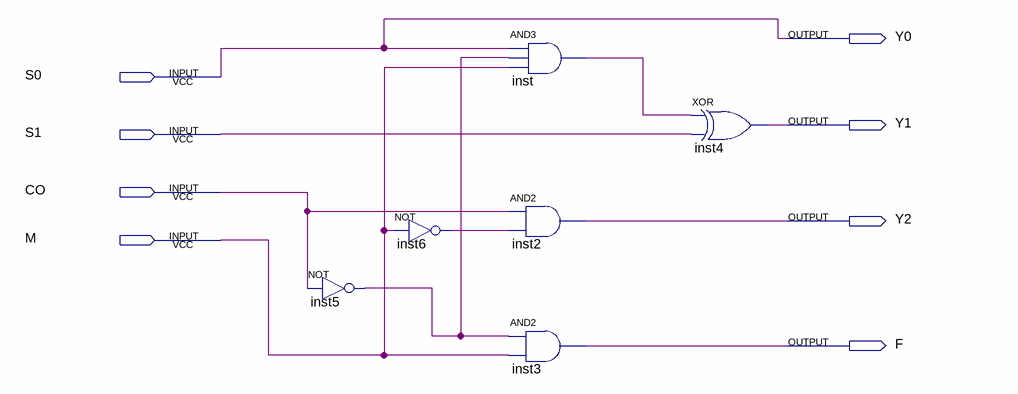
[diagram p0: schematic sheet]
// Quartus schematic decoder.bdf as structural Verilog: 6 symbols, 8 pins
module decoder (
  input  S0,
  input  S1,
  input  CO,
  input  M,
  output Y0,
  output Y1,
  output Y2,
  output F
);

  wire inst5_out, inst6_out, inst_out;

  not inst5 (inst5_out, CO);
  not inst6 (inst6_out, M);
  and inst (inst_out, S0, inst5_out, M);
  and inst2 (Y2, CO, inst6_out);
  and inst3 (F, inst5_out, M);
  xor inst4 (Y1, inst_out, S1);

  assign Y0 = S0;
endmodule
